# Altium project Stand Alone Braille Tutor.PrjPCB
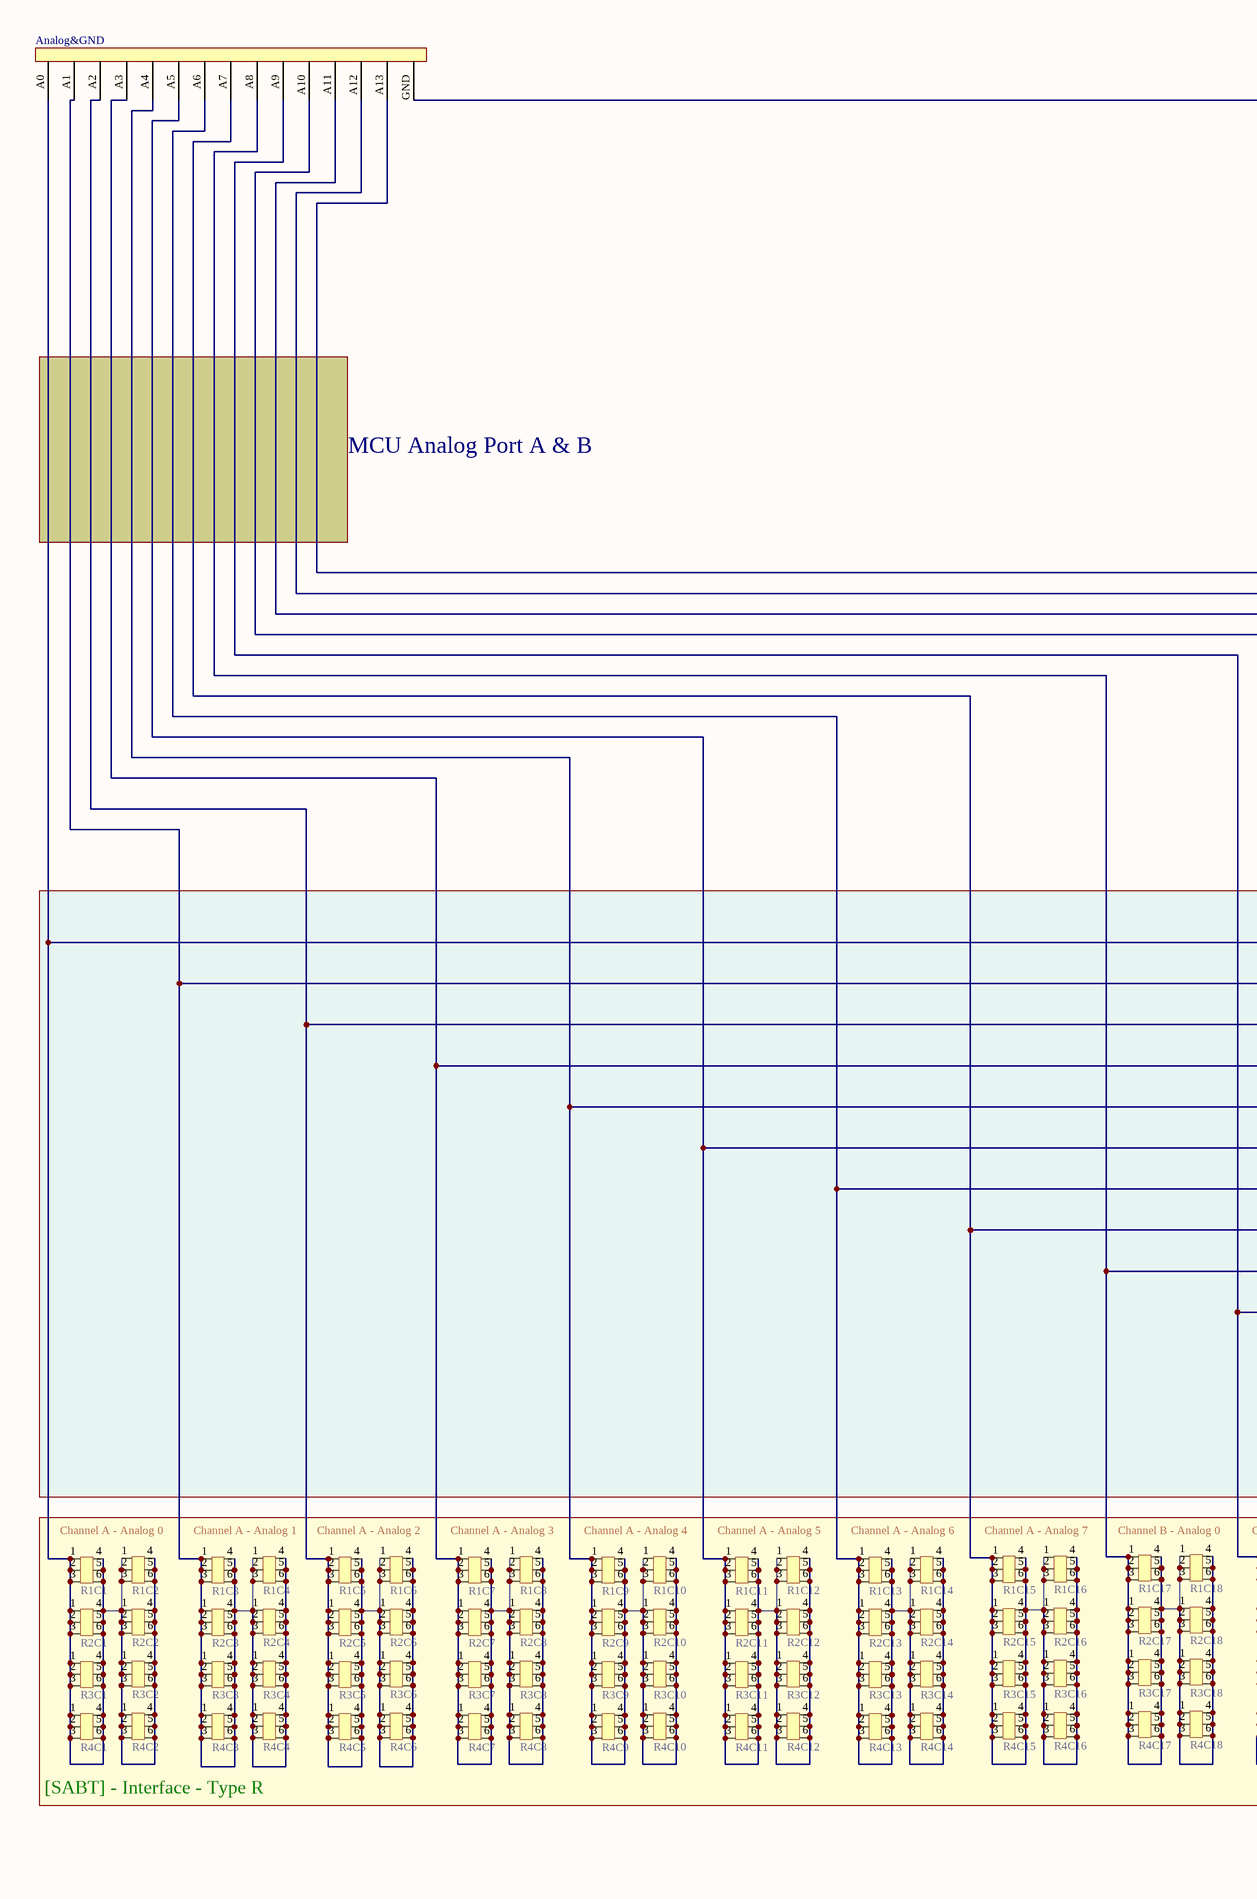
[diagram p0: ISO-ASS[3].SchDoc, left]
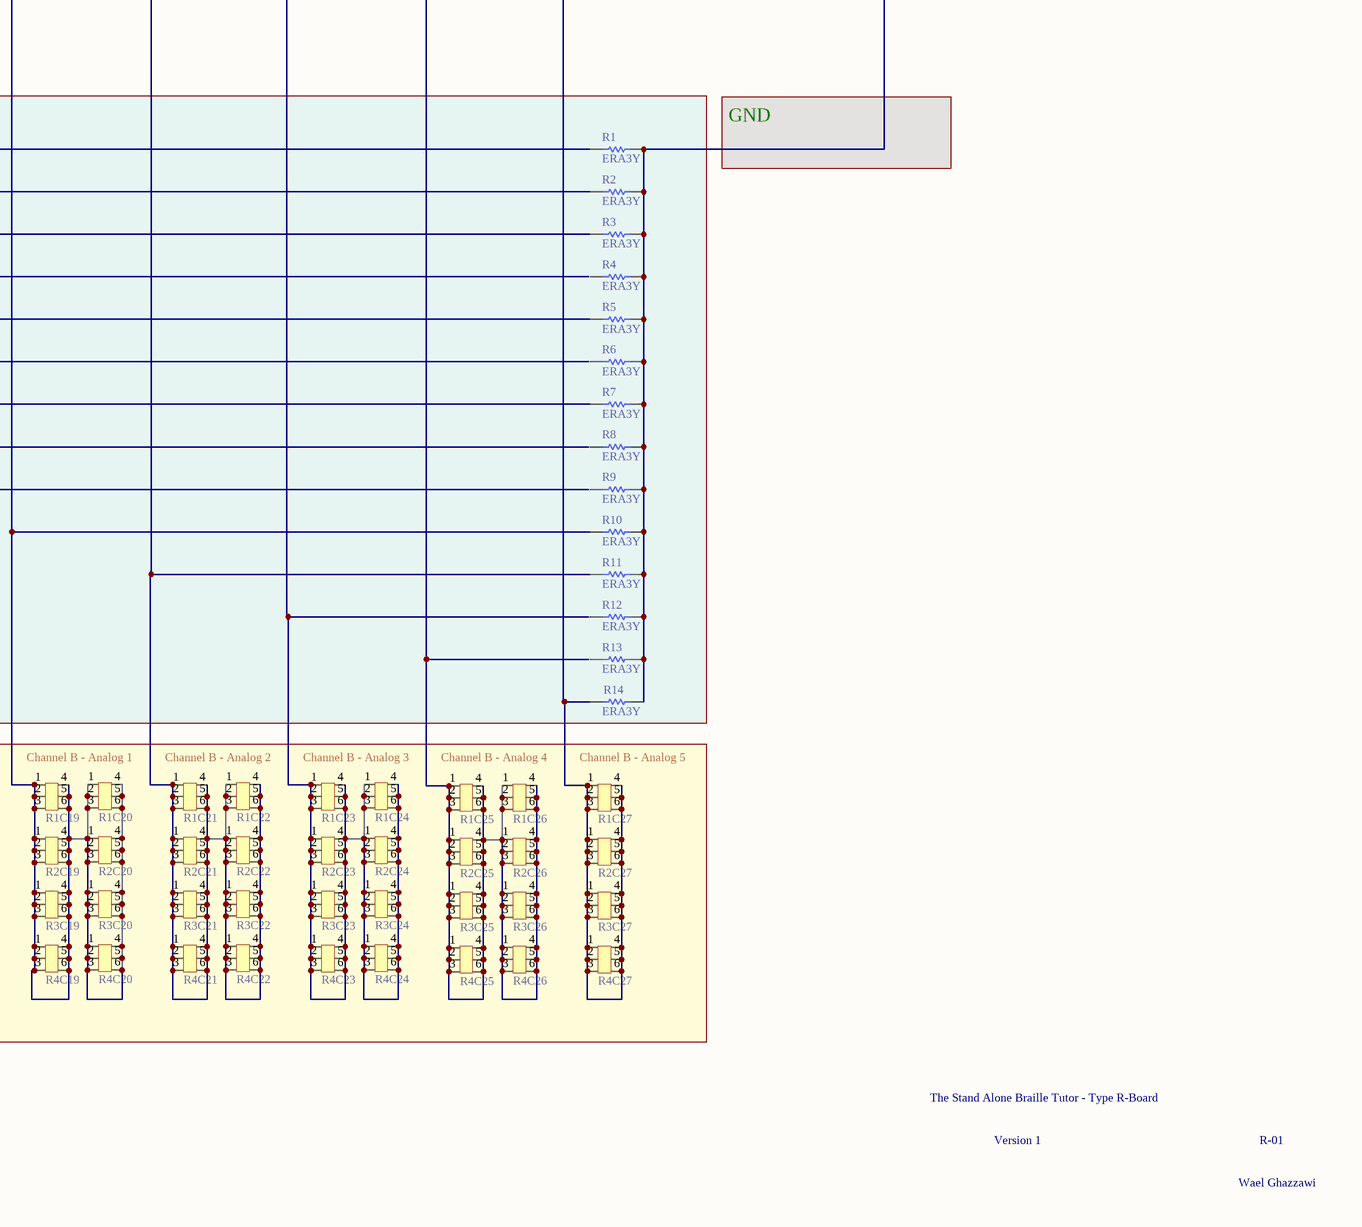
[diagram p1: ISO-ASS[3].SchDoc, right]
1 sheet, 123 parts. Net scope: global (net labels, ports and power ports of the same name join across sheets).
Board files: ISO-ASS[3]-R.PcbDoc, ISO-ASS[3]-R-RC1.PcbDoc

## Sheet ISO-ASS[3].SchDoc
size 500 x 400 mm; Author: Wael Ghazzawi; DrawnBy: Wael Ghazzawi; Engineer: Wael Ghazzawi; Organization: Carngie Mellon University Qatar; Revision: R-01; SheetNumber: 1; SheetTotal: 2

### Parts
Analog&GND  Analog_Connector  [Analog_Connector]  (value not drawn)
R1  ERA3Y  [ERA-0603]
R1C1  BC-ASS[3]  [BC-ASS[3]]  (value not drawn)
R1C2  BC-ASS[3]  [BC-ASS[3]]  (value not drawn)
R1C3  BC-ASS[3]  [BC-ASS[3]]  (value not drawn)
R1C4  BC-ASS[3]  [BC-ASS[3]]  (value not drawn)
R1C5  BC-ASS[3]  [BC-ASS[3]]  (value not drawn)
R1C6  BC-ASS[3]  [BC-ASS[3]]  (value not drawn)
R1C7  BC-ASS[3]  [BC-ASS[3]]  (value not drawn)
R1C8  BC-ASS[3]  [BC-ASS[3]]  (value not drawn)
R1C9  BC-ASS[3]  [BC-ASS[3]]  (value not drawn)
R1C10  BC-ASS[3]  [BC-ASS[3]]  (value not drawn)
R1C11  BC-ASS[3]  [BC-ASS[3]]  (value not drawn)
R1C12  BC-ASS[3]  [BC-ASS[3]]  (value not drawn)
R1C13  BC-ASS[3]  [BC-ASS[3]]  (value not drawn)
R1C14  BC-ASS[3]  [BC-ASS[3]]  (value not drawn)
R1C15  BC-ASS[3]  [BC-ASS[3]]  (value not drawn)
R1C16  BC-ASS[3]  [BC-ASS[3]]  (value not drawn)
R1C17  BC-ASS[3]  [BC-ASS[3]]  (value not drawn)
R1C18  BC-ASS[3]  [BC-ASS[3]]  (value not drawn)
R1C19  BC-ASS[3]  [BC-ASS[3]]  (value not drawn)
R1C20  BC-ASS[3]  [BC-ASS[3]]  (value not drawn)
R1C21  BC-ASS[3]  [BC-ASS[3]]  (value not drawn)
R1C22  BC-ASS[3]  [BC-ASS[3]]  (value not drawn)
R1C23  BC-ASS[3]  [BC-ASS[3]]  (value not drawn)
R1C24  BC-ASS[3]  [BC-ASS[3]]  (value not drawn)
R1C25  BC-ASS[3]  [BC-ASS[3]]  (value not drawn)
R1C26  BC-ASS[3]  [BC-ASS[3]]  (value not drawn)
R1C27  BC-ASS[3]  [BC-ASS[3]]  (value not drawn)
R2  ERA3Y  [ERA-0603]
R2C1  BC-ASS[3]  [BC-ASS[3]]  (value not drawn)
R2C2  BC-ASS[3]  [BC-ASS[3]]  (value not drawn)
R2C3  BC-ASS[3]  [BC-ASS[3]]  (value not drawn)
R2C4  BC-ASS[3]  [BC-ASS[3]]  (value not drawn)
R2C5  BC-ASS[3]  [BC-ASS[3]]  (value not drawn)
R2C6  BC-ASS[3]  [BC-ASS[3]]  (value not drawn)
R2C7  BC-ASS[3]  [BC-ASS[3]]  (value not drawn)
R2C8  BC-ASS[3]  [BC-ASS[3]]  (value not drawn)
R2C9  BC-ASS[3]  [BC-ASS[3]]  (value not drawn)
R2C10  BC-ASS[3]  [BC-ASS[3]]  (value not drawn)
R2C11  BC-ASS[3]  [BC-ASS[3]]  (value not drawn)
R2C12  BC-ASS[3]  [BC-ASS[3]]  (value not drawn)
R2C13  BC-ASS[3]  [BC-ASS[3]]  (value not drawn)
R2C14  BC-ASS[3]  [BC-ASS[3]]  (value not drawn)
R2C15  BC-ASS[3]  [BC-ASS[3]]  (value not drawn)
R2C16  BC-ASS[3]  [BC-ASS[3]]  (value not drawn)
R2C17  BC-ASS[3]  [BC-ASS[3]]  (value not drawn)
R2C18  BC-ASS[3]  [BC-ASS[3]]  (value not drawn)
R2C19  BC-ASS[3]  [BC-ASS[3]]  (value not drawn)
R2C20  BC-ASS[3]  [BC-ASS[3]]  (value not drawn)
R2C21  BC-ASS[3]  [BC-ASS[3]]  (value not drawn)
R2C22  BC-ASS[3]  [BC-ASS[3]]  (value not drawn)
R2C23  BC-ASS[3]  [BC-ASS[3]]  (value not drawn)
R2C24  BC-ASS[3]  [BC-ASS[3]]  (value not drawn)
R2C25  BC-ASS[3]  [BC-ASS[3]]  (value not drawn)
R2C26  BC-ASS[3]  [BC-ASS[3]]  (value not drawn)
R2C27  BC-ASS[3]  [BC-ASS[3]]  (value not drawn)
R3  ERA3Y  [ERA-0603]
R3C1  BC-ASS[3]  [BC-ASS[3]]  (value not drawn)
R3C2  BC-ASS[3]  [BC-ASS[3]]  (value not drawn)
R3C3  BC-ASS[3]  [BC-ASS[3]]  (value not drawn)
R3C4  BC-ASS[3]  [BC-ASS[3]]  (value not drawn)
R3C5  BC-ASS[3]  [BC-ASS[3]]  (value not drawn)
R3C6  BC-ASS[3]  [BC-ASS[3]]  (value not drawn)
R3C7  BC-ASS[3]  [BC-ASS[3]]  (value not drawn)
R3C8  BC-ASS[3]  [BC-ASS[3]]  (value not drawn)
R3C9  BC-ASS[3]  [BC-ASS[3]]  (value not drawn)
R3C10  BC-ASS[3]  [BC-ASS[3]]  (value not drawn)
R3C11  BC-ASS[3]  [BC-ASS[3]]  (value not drawn)
R3C12  BC-ASS[3]  [BC-ASS[3]]  (value not drawn)
R3C13  BC-ASS[3]  [BC-ASS[3]]  (value not drawn)
R3C14  BC-ASS[3]  [BC-ASS[3]]  (value not drawn)
R3C15  BC-ASS[3]  [BC-ASS[3]]  (value not drawn)
R3C16  BC-ASS[3]  [BC-ASS[3]]  (value not drawn)
R3C17  BC-ASS[3]  [BC-ASS[3]]  (value not drawn)
R3C18  BC-ASS[3]  [BC-ASS[3]]  (value not drawn)
R3C19  BC-ASS[3]  [BC-ASS[3]]  (value not drawn)
R3C20  BC-ASS[3]  [BC-ASS[3]]  (value not drawn)
R3C21  BC-ASS[3]  [BC-ASS[3]]  (value not drawn)
R3C22  BC-ASS[3]  [BC-ASS[3]]  (value not drawn)
R3C23  BC-ASS[3]  [BC-ASS[3]]  (value not drawn)
R3C24  BC-ASS[3]  [BC-ASS[3]]  (value not drawn)
R3C25  BC-ASS[3]  [BC-ASS[3]]  (value not drawn)
R3C26  BC-ASS[3]  [BC-ASS[3]]  (value not drawn)
R3C27  BC-ASS[3]  [BC-ASS[3]]  (value not drawn)
R4  ERA3Y  [ERA-0603]
R4C1  BC-ASS[3]  [BC-ASS[3]]  (value not drawn)
R4C2  BC-ASS[3]  [BC-ASS[3]]  (value not drawn)
R4C3  BC-ASS[3]  [BC-ASS[3]]  (value not drawn)
R4C4  BC-ASS[3]  [BC-ASS[3]]  (value not drawn)
R4C5  BC-ASS[3]  [BC-ASS[3]]  (value not drawn)
R4C6  BC-ASS[3]  [BC-ASS[3]]  (value not drawn)
R4C7  BC-ASS[3]  [BC-ASS[3]]  (value not drawn)
R4C8  BC-ASS[3]  [BC-ASS[3]]  (value not drawn)
R4C9  BC-ASS[3]  [BC-ASS[3]]  (value not drawn)
R4C10  BC-ASS[3]  [BC-ASS[3]]  (value not drawn)
R4C11  BC-ASS[3]  [BC-ASS[3]]  (value not drawn)
R4C12  BC-ASS[3]  [BC-ASS[3]]  (value not drawn)
R4C13  BC-ASS[3]  [BC-ASS[3]]  (value not drawn)
R4C14  BC-ASS[3]  [BC-ASS[3]]  (value not drawn)
R4C15  BC-ASS[3]  [BC-ASS[3]]  (value not drawn)
R4C16  BC-ASS[3]  [BC-ASS[3]]  (value not drawn)
R4C17  BC-ASS[3]  [BC-ASS[3]]  (value not drawn)
R4C18  BC-ASS[3]  [BC-ASS[3]]  (value not drawn)
R4C19  BC-ASS[3]  [BC-ASS[3]]  (value not drawn)
R4C20  BC-ASS[3]  [BC-ASS[3]]  (value not drawn)
R4C21  BC-ASS[3]  [BC-ASS[3]]  (value not drawn)
R4C22  BC-ASS[3]  [BC-ASS[3]]  (value not drawn)
R4C23  BC-ASS[3]  [BC-ASS[3]]  (value not drawn)
R4C24  BC-ASS[3]  [BC-ASS[3]]  (value not drawn)
R4C25  BC-ASS[3]  [BC-ASS[3]]  (value not drawn)
R4C26  BC-ASS[3]  [BC-ASS[3]]  (value not drawn)
R4C27  BC-ASS[3]  [BC-ASS[3]]  (value not drawn)
R5  ERA3Y  [ERA-0603]
R6  ERA3Y  [ERA-0603]
R7  ERA3Y  [ERA-0603]
R8  ERA3Y  [ERA-0603]
R9  ERA3Y  [ERA-0603]
R10  ERA3Y  [ERA-0603]
R11  ERA3Y  [ERA-0603]
R12  ERA3Y  [ERA-0603]
R13  ERA3Y  [ERA-0603]
R14  ERA3Y  [ERA-0603]

### Blocks framed on the sheet
[SABT] - Interface - Type R: R1C1-R1C27 R2C1-R2C27 R3C1-R3C27 R4C1-R4C27

### Nets
NetAnalog&GND_A0: Analog&GND.A0 R1.1 R1C1.1 R1C1.2 R1C1.3 R1C1.4 R1C1.5 R1C1.6 R1C2.1 R1C2.2 R1C2.3 R1C2.4 R1C2.5 R1C2.6 R2C1.1 R2C1.2 R2C1.3 R2C1.4 R2C1.5 R2C1.6 R2C2.1 R2C2.2 R2C2.3 R2C2.4 R2C2.5 R2C2.6 R3C1.1 R3C1.2 R3C1.3 R3C1.4 R3C1.5 R3C1.6 R3C2.1 R3C2.2 R3C2.3 R3C2.4 R3C2.5 R3C2.6 R4C1.1 R4C1.2 R4C1.3 R4C1.4 R4C1.5 R4C1.6 R4C2.1 R4C2.2 R4C2.3 R4C2.4 R4C2.5 R4C2.6
NetAnalog&GND_A1: Analog&GND.A1 R1C3.1 R1C3.2 R1C3.3 R1C3.4 R1C3.5 R1C3.6 R1C4.1 R1C4.2 R1C4.3 R1C4.4 R1C4.5 R1C4.6 R2.1 R2C3.1 R2C3.2 R2C3.3 R2C3.4 R2C3.5 R2C3.6 R2C4.1 R2C4.2 R2C4.3 R2C4.4 R2C4.5 R2C4.6 R3C3.1 R3C3.2 R3C3.3 R3C3.4 R3C3.5 R3C3.6 R3C4.1 R3C4.2 R3C4.3 R3C4.4 R3C4.5 R3C4.6 R4C3.1 R4C3.2 R4C3.3 R4C3.4 R4C3.5 R4C3.6 R4C4.1 R4C4.2 R4C4.3 R4C4.4 R4C4.5 R4C4.6
NetAnalog&GND_A2: Analog&GND.A2 R1C5.1 R1C5.2 R1C5.3 R1C5.4 R1C5.5 R1C5.6 R1C6.1 R1C6.2 R1C6.3 R1C6.4 R1C6.5 R1C6.6 R2C5.1 R2C5.2 R2C5.3 R2C5.4 R2C5.5 R2C5.6 R2C6.1 R2C6.2 R2C6.3 R2C6.4 R2C6.5 R2C6.6 R3.1 R3C5.1 R3C5.2 R3C5.3 R3C5.4 R3C5.5 R3C5.6 R3C6.1 R3C6.2 R3C6.3 R3C6.4 R3C6.5 R3C6.6 R4C5.1 R4C5.2 R4C5.3 R4C5.4 R4C5.5 R4C5.6 R4C6.1 R4C6.2 R4C6.3 R4C6.4 R4C6.5 R4C6.6
NetAnalog&GND_A3: Analog&GND.A3 R1C7.1 R1C7.2 R1C7.3 R1C7.4 R1C7.5 R1C7.6 R1C8.1 R1C8.2 R1C8.3 R1C8.4 R1C8.5 R1C8.6 R2C7.1 R2C7.2 R2C7.3 R2C7.4 R2C7.5 R2C7.6 R2C8.1 R2C8.2 R2C8.3 R2C8.4 R2C8.5 R2C8.6 R3C7.1 R3C7.2 R3C7.3 R3C7.4 R3C7.5 R3C7.6 R3C8.1 R3C8.2 R3C8.3 R3C8.4 R3C8.5 R3C8.6 R4C7.1 R4C7.2 R4C7.3 R4C7.4 R4C7.5 R4C7.6 R4C8.1 R4C8.2 R4C8.3 R4C8.4 R4C8.5 R4C8.6
NetAnalog&GND_A4: Analog&GND.A4 R1C9.1 R1C9.2 R1C9.3 R1C9.4 R1C9.5 R1C9.6 R1C10.1 R1C10.2 R1C10.3 R1C10.4 R1C10.5 R1C10.6 R2C9.1 R2C9.2 R2C9.3 R2C9.4 R2C9.5 R2C9.6 R2C10.1 R2C10.2 R2C10.3 R2C10.4 R2C10.5 R2C10.6 R3C9.1 R3C9.2 R3C9.3 R3C9.4 R3C9.5 R3C9.6 R3C10.1 R3C10.2 R3C10.3 R3C10.4 R3C10.5 R3C10.6 R4C9.1 R4C9.2 R4C9.3 R4C9.4 R4C9.5 R4C9.6 R4C10.1 R4C10.2 R4C10.3 R4C10.4 R4C10.5 R4C10.6 R5.1
NetAnalog&GND_A5: Analog&GND.A5 R1C11.1 R1C11.2 R1C11.3 R1C11.4 R1C11.5 R1C11.6 R1C12.1 R1C12.2 R1C12.3 R1C12.4 R1C12.5 R1C12.6 R2C11.1 R2C11.2 R2C11.3 R2C11.4 R2C11.5 R2C11.6 R2C12.1 R2C12.2 R2C12.3 R2C12.4 R2C12.5 R2C12.6 R3C11.1 R3C11.2 R3C11.3 R3C11.4 R3C11.5 R3C11.6 R3C12.1 R3C12.2 R3C12.3 R3C12.4 R3C12.5 R3C12.6 R4C11.1 R4C11.2 R4C11.3 R4C11.4 R4C11.5 R4C11.6 R4C12.1 R4C12.2 R4C12.3 R4C12.4 R4C12.5 R4C12.6
NetAnalog&GND_A6: Analog&GND.A6 R1C13.1 R1C13.2 R1C13.3 R1C13.4 R1C13.5 R1C13.6 R1C14.1 R1C14.2 R1C14.3 R1C14.4 R1C14.5 R1C14.6 R2C13.1 R2C13.2 R2C13.3 R2C13.4 R2C13.5 R2C13.6 R2C14.1 R2C14.2 R2C14.3 R2C14.4 R2C14.5 R2C14.6 R3C13.1 R3C13.2 R3C13.3 R3C13.4 R3C13.5 R3C13.6 R3C14.1 R3C14.2 R3C14.3 R3C14.4 R3C14.5 R3C14.6 R4C13.1 R4C13.2 R4C13.3 R4C13.4 R4C13.5 R4C13.6 R4C14.1 R4C14.2 R4C14.3 R4C14.4 R4C14.5 R4C14.6 R7.1
NetAnalog&GND_A7: Analog&GND.A7 R1C15.1 R1C15.2 R1C15.3 R1C15.4 R1C15.5 R1C15.6 R1C16.1 R1C16.2 R1C16.3 R1C16.4 R1C16.5 R1C16.6 R2C15.1 R2C15.2 R2C15.3 R2C15.4 R2C15.5 R2C15.6 R2C16.1 R2C16.2 R2C16.3 R2C16.4 R2C16.5 R2C16.6 R3C15.1 R3C15.2 R3C15.3 R3C15.4 R3C15.5 R3C15.6 R3C16.1 R3C16.2 R3C16.3 R3C16.4 R3C16.5 R3C16.6 R4C15.1 R4C15.2 R4C15.3 R4C15.4 R4C15.5 R4C15.6 R4C16.1 R4C16.2 R4C16.3 R4C16.4 R4C16.5 R4C16.6
NetAnalog&GND_A8: Analog&GND.A8 R1C17.1 R1C17.2 R1C17.3 R1C17.4 R1C17.5 R1C17.6 R1C18.1 R1C18.2 R1C18.3 R1C18.4 R1C18.5 R1C18.6 R2C17.1 R2C17.2 R2C17.3 R2C17.4 R2C17.5 R2C17.6 R2C18.1 R2C18.2 R2C18.3 R2C18.4 R2C18.5 R2C18.6 R3C17.1 R3C17.2 R3C17.3 R3C17.4 R3C17.5 R3C17.6 R3C18.1 R3C18.2 R3C18.3 R3C18.4 R3C18.5 R3C18.6 R4C17.1 R4C17.2 R4C17.3 R4C17.4 R4C17.5 R4C17.6 R4C18.1 R4C18.2 R4C18.3 R4C18.4 R4C18.5 R4C18.6
NetAnalog&GND_A9: Analog&GND.A9 R1C19.1 R1C19.2 R1C19.3 R1C19.4 R1C19.5 R1C19.6 R1C20.1 R1C20.2 R1C20.3 R1C20.4 R1C20.5 R1C20.6 R2C19.1 R2C19.2 R2C19.3 R2C19.4 R2C19.5 R2C19.6 R2C20.1 R2C20.2 R2C20.3 R2C20.4 R2C20.5 R2C20.6 R3C19.1 R3C19.2 R3C19.3 R3C19.4 R3C19.5 R3C19.6 R3C20.1 R3C20.2 R3C20.3 R3C20.4 R3C20.5 R3C20.6 R4C19.1 R4C19.2 R4C19.3 R4C19.4 R4C19.5 R4C19.6 R4C20.1 R4C20.2 R4C20.3 R4C20.4 R4C20.5 R4C20.6 R10.1
NetAnalog&GND_A10: Analog&GND.A10 R1C21.1 R1C21.2 R1C21.3 R1C21.4 R1C21.5 R1C21.6 R1C22.1 R1C22.2 R1C22.3 R1C22.4 R1C22.5 R1C22.6 R2C21.1 R2C21.2 R2C21.3 R2C21.4 R2C21.5 R2C21.6 R2C22.1 R2C22.2 R2C22.3 R2C22.4 R2C22.5 R2C22.6 R3C21.1 R3C21.2 R3C21.3 R3C21.4 R3C21.5 R3C21.6 R3C22.1 R3C22.2 R3C22.3 R3C22.4 R3C22.5 R3C22.6 R4C21.1 R4C21.2 R4C21.3 R4C21.4 R4C21.5 R4C21.6 R4C22.1 R4C22.2 R4C22.3 R4C22.4 R4C22.5 R4C22.6 R11.1
NetAnalog&GND_A11: Analog&GND.A11 R1C23.1 R1C23.2 R1C23.3 R1C23.4 R1C23.5 R1C23.6 R1C24.1 R1C24.2 R1C24.3 R1C24.4 R1C24.5 R1C24.6 R2C23.1 R2C23.2 R2C23.3 R2C23.4 R2C23.5 R2C23.6 R2C24.1 R2C24.2 R2C24.3 R2C24.4 R2C24.5 R2C24.6 R3C23.1 R3C23.2 R3C23.3 R3C23.4 R3C23.5 R3C23.6 R3C24.1 R3C24.2 R3C24.3 R3C24.4 R3C24.5 R3C24.6 R4C23.1 R4C23.2 R4C23.3 R4C23.4 R4C23.5 R4C23.6 R4C24.1 R4C24.2 R4C24.3 R4C24.4 R4C24.5 R4C24.6
NetAnalog&GND_A12: Analog&GND.A12 R1C25.1 R1C25.2 R1C25.3 R1C25.4 R1C25.5 R1C25.6 R1C26.1 R1C26.2 R1C26.3 R1C26.4 R1C26.5 R1C26.6 R2C25.1 R2C25.2 R2C25.3 R2C25.4 R2C25.5 R2C25.6 R2C26.1 R2C26.2 R2C26.3 R2C26.4 R2C26.5 R2C26.6 R3C25.1 R3C25.2 R3C25.3 R3C25.4 R3C25.5 R3C25.6 R3C26.1 R3C26.2 R3C26.3 R3C26.4 R3C26.5 R3C26.6 R4C25.1 R4C25.2 R4C25.3 R4C25.4 R4C25.5 R4C25.6 R4C26.1 R4C26.2 R4C26.3 R4C26.4 R4C26.5 R4C26.6
NetAnalog&GND_A13: Analog&GND.A13 R1C27.1 R1C27.2 R1C27.3 R1C27.4 R1C27.5 R1C27.6 R2C27.1 R2C27.2 R2C27.3 R2C27.4 R2C27.5 R2C27.6 R3C27.1 R3C27.2 R3C27.3 R3C27.4 R3C27.5 R3C27.6 R4C27.1 R4C27.2 R4C27.3 R4C27.4 R4C27.5 R4C27.6 R14.1
NetAnalog&GND_GND: Analog&GND.GND R1.2 R2.2 R3.2 R4.2 R5.2 R6.2 R7.2 R8.2 R9.2 R10.2 R11.2 R12.2 R13.2 R14.2

Not connected (* = marked no-connect by the designer): R4 1; R6 1; R8 1; R9 1; R12 1; R13 1

### Notes on the sheet
- MCU Analog Port A & B
- GND
- The Stand Alone Braille Tutor - Type R-Board
- Version 1
- R-01
- Wael Ghazzawi
- Labels drawn without touching a wire or pin: Channel A - Analog 0, Channel A - Analog 1, Channel A - Analog 2, Channel A - Analog 3, Channel A - Analog 4, Channel A - Analog 5, Channel A - Analog 6, Channel A - Analog 7, Channel B - Analog 0, Channel B - Analog 1, Channel B - Analog 2, Channel B - Analog 3, Channel B - Analog 4, Channel B - Analog 5

### Library data of the parts
R1-R14 = ERA3Y: Rectangular Thick Film Chip Resistor, 10 Ohm to 330k Ohm Range, 0.1% and 0.5% Tolerance, 0603 Size, 0.063 W; Note: If flow soldering, adjust pad width of PCB Footprint to 0.7 - 0.8 times the width of the resistor.; Published: 17-Dec-2003; LatestRevisionDate: 19-Mar-2004; LatestRevisionNote: Silkscreen size reduced.; PackageDocument: Mar-2003; PackageReference: ERA-0603; Publisher: Altium Limited; Code_IPC: 1608 [0603]; ComponentLink1Description: Manufacturer Link; ComponentLink1URL: http://www.panasonic.com/industrial/components/resistive_products.htm; ComponentLink2Description: Datasheet; ComponentLink2URL: http://www.panasonic.com/industrial/components/pdf/AOA0000CE8.pdf